# EAGLE design CoCoEPROMpak (EAGLE 6.4)
COMPANY_NAME: Mark J. Blair, NF6X; DOCUMENT_ID: CoCoEPROMpak_v1.0; REV: 1.0
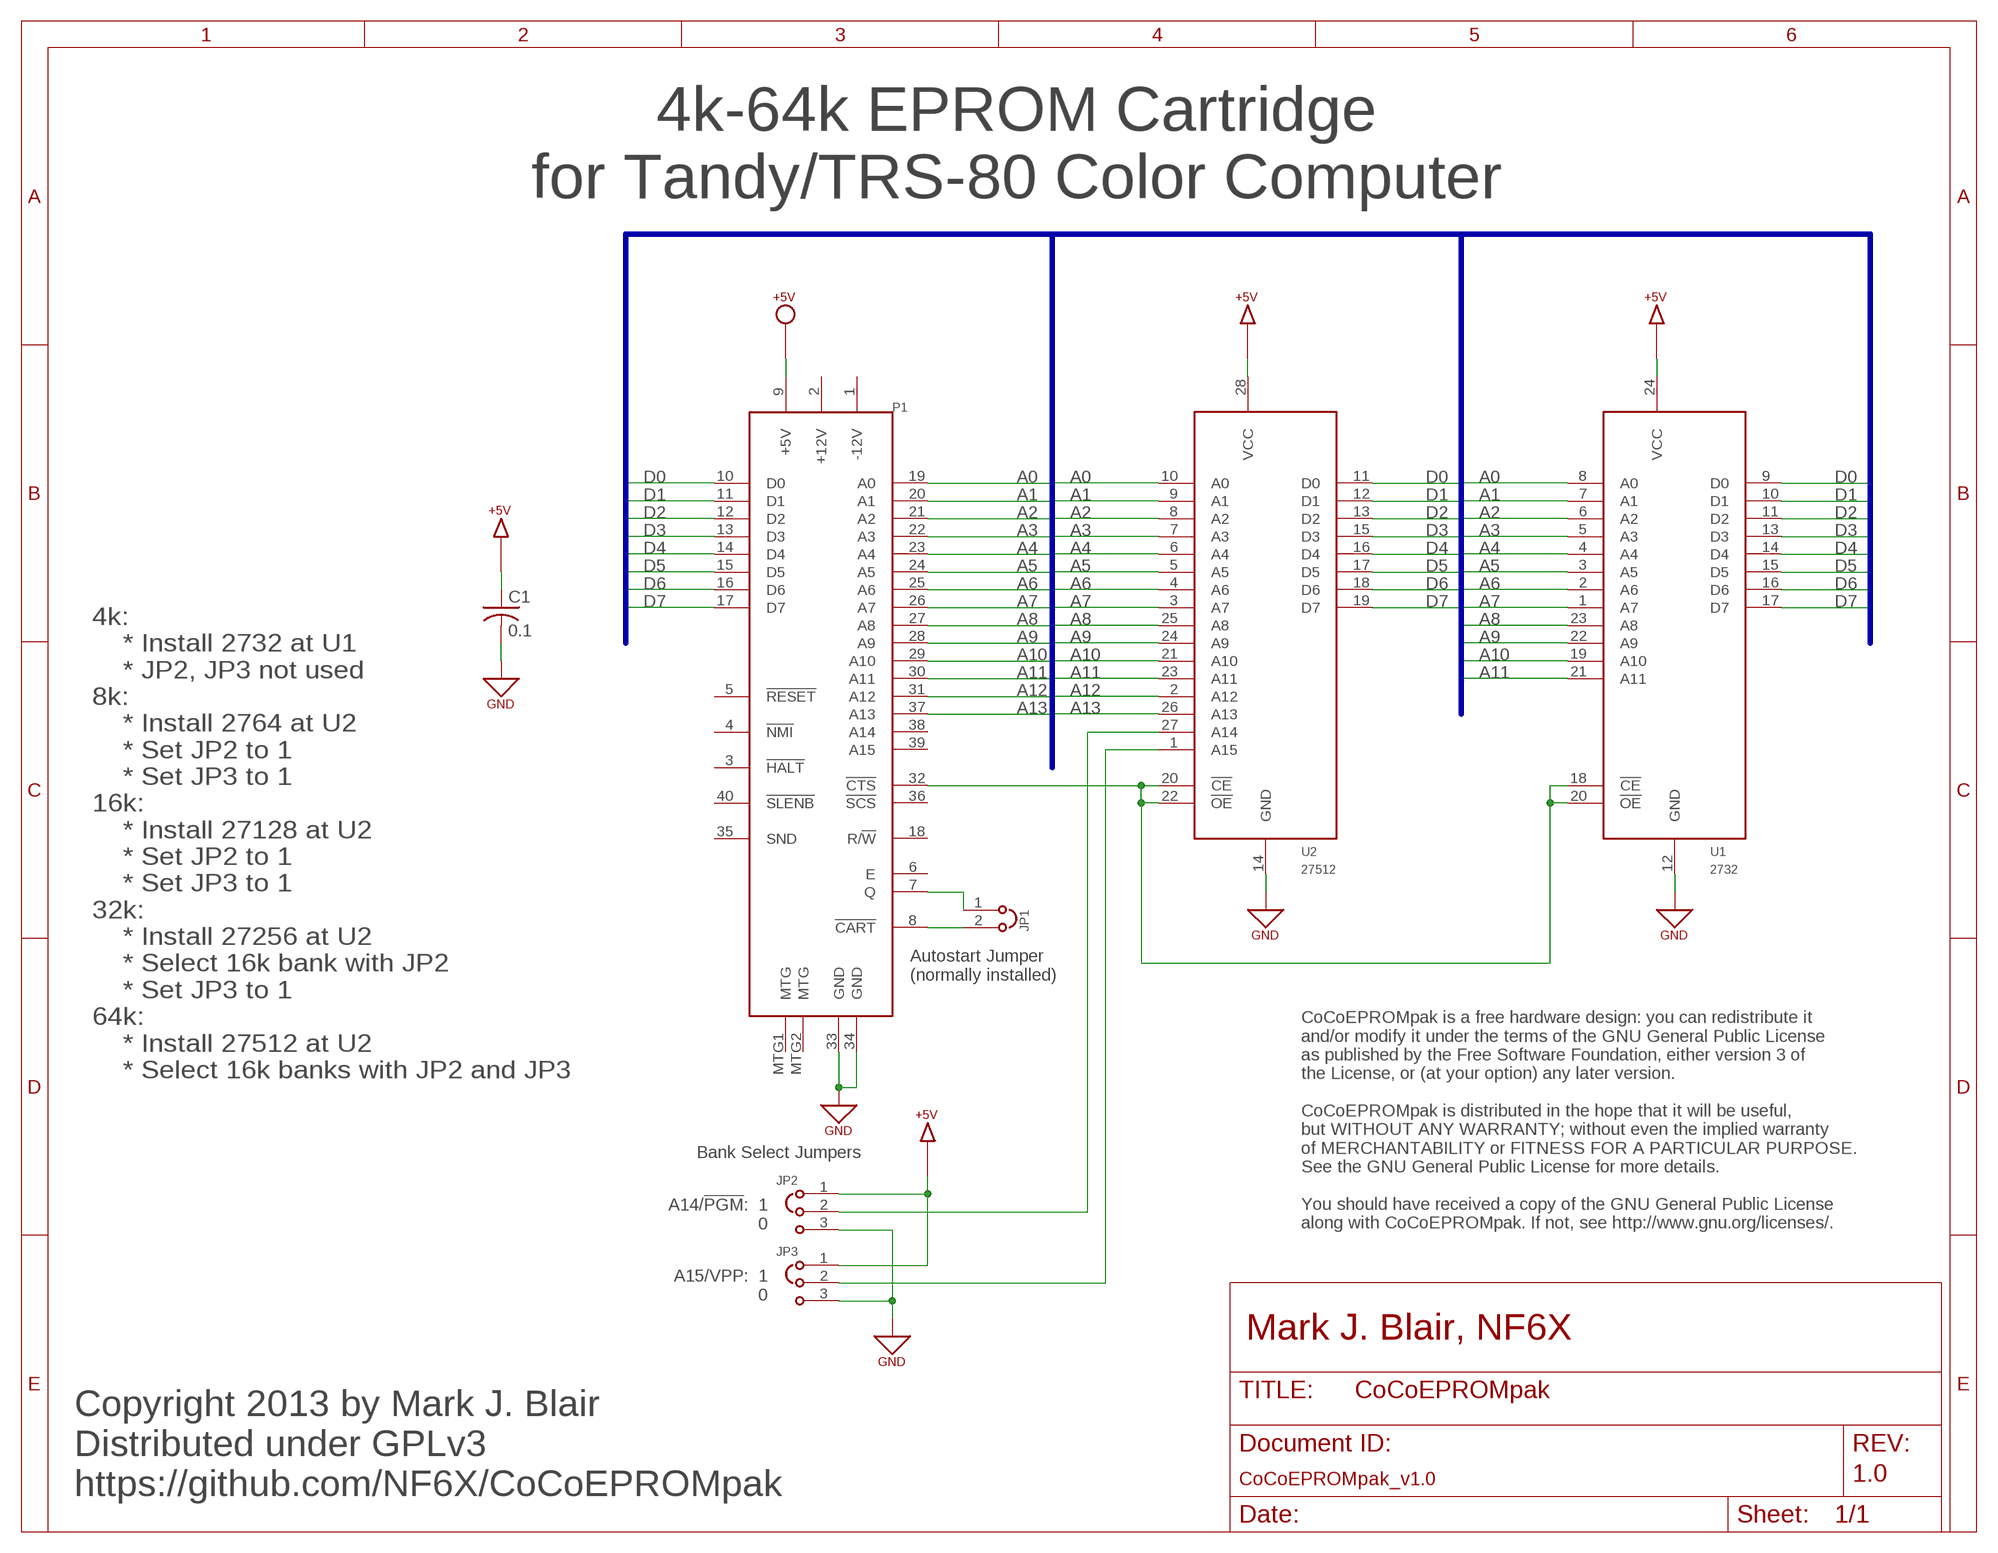
[diagram p0: schematic, sheet 1]

## Parts
C1  0.1  C-US050-025X075  [C050-025X075]
JP1  JP2  [JP2-100MIL]
JP2  JP3  [JP3-100MIL]
JP3  JP3  [JP3-100MIL]
P1  COCO-CART  [COCO-CART-2.1X1.75]
U1  2732  [DIL24]
U2  27512  [DIL28]

## Nets
+5V: C1.1 JP2.1 JP3.1 P1.9(+5V) U1.24(VCC) U2.28(VCC) ; supply symbol labelled +5V_CIRCLE, +5V_ARROW
A0: P1.19(A0) U1.8(A0) U2.10(A0)
A1: P1.20(A1) U1.7(A1) U2.9(A1)
A2: P1.21(A2) U1.6(A2) U2.8(A2)
A3: P1.22(A3) U1.5(A3) U2.7(A3)
A4: P1.23(A4) U1.4(A4) U2.6(A4)
A5: P1.24(A5) U1.3(A5) U2.5(A5)
A6: P1.25(A6) U1.2(A6) U2.4(A6)
A7: P1.26(A7) U1.1(A7) U2.3(A7)
A8: P1.27(A8) U1.23(A8) U2.25(A8)
A9: P1.28(A9) U1.22(A9) U2.24(A9)
A10: P1.29(A10) U1.19(A10) U2.21(A10)
A11: P1.30(A11) U1.21(A11) U2.23(A11)
A12: P1.31(A12) U2.2(A12)
A13: P1.37(A13) U2.26(A13)
D0: P1.10(D0) U1.9(D0) U2.11(D0)
D1: P1.11(D1) U1.10(D1) U2.12(D1)
D2: P1.12(D2) U1.11(D2) U2.13(D2)
D3: P1.13(D3) U1.13(D3) U2.15(D3)
D4: P1.14(D4) U1.14(D4) U2.16(D4)
D5: P1.15(D5) U1.15(D5) U2.17(D5)
D6: P1.16(D6) U1.16(D6) U2.18(D6)
D7: P1.17(D7) U1.17(D7) U2.19(D7)
GND: C1.2 JP2.3 JP3.3 P1.33(GND) P1.34(GND) U1.12(GND) U2.14(GND)
N$1: JP2.2 U2.27(A14)
N$2: P1.32(!CTS) U1.18(!CE) U1.20(!OE) U2.20(!CE) U2.22(!OE)
N$3: JP3.2 U2.1(A15)
N$4: JP1.2 P1.8(!CART)
N$5: JP1.1 P1.7(Q)
Unconnected: P1.1(-12V) P1.2(+12V) P1.3(!HALT) P1.4(!NMI) P1.5(!RESET) P1.6(E) P1.18(R/!W) P1.35(SND) P1.36(!SCS) P1.38(A14) P1.39(A15) P1.40(!SLENB) P1.MTG1(MTG) P1.MTG2(MTG)

## Buses
AD:A[0..13],D[0..7]

## Notes on the sheet
- 4k-64k EPROM Cartridge
  for Tandy/TRS-80 Color Computer
- Autostart Jumper
  (normally installed)
- 4k:
      * Install 2732 at U1
      * JP2, JP3 not used
  8k:
      * Install 2764 at U2
      * Set JP2 to 1
      * Set JP3 to 1
  16k:
      * Install 27128 at U2
      * Set JP2 to 1
      * Set JP3 to 1
  32k:
      * Install 27256 at U2
      * Select 16k bank with JP2
      * Set JP3 to 1
  64k:
      * Install 27512 at U2
      * Select 16k banks with JP2 and JP3
- Bank Select Jumpers
- A14/!PGM!:  1
  0
- CoCoEPROMpak is a free hardware design: you can redistribute it
  and/or modify it under the terms of the GNU General Public License
  as published by the Free Software Foundation, either version 3 of
  the License, or (at your option) any later version.
  
  CoCoEPROMpak is distributed in the hope that it will be useful,
  but WITHOUT ANY WARRANTY; without even the implied warranty
  of MERCHANTABILITY or FITNESS FOR A PARTICULAR PURPOSE.
  See the GNU General Public License for more details.
  
  You should have received a copy of the GNU General Public License
  along with CoCoEPROMpak. If not, see http://www.gnu.org/licenses/.
- A15/VPP:  1
  0
- Copyright 2013 by Mark J. Blair
  Distributed under GPLv3
  https://github.com/NF6X/CoCoEPROMpak

## Library data of the parts
C1 = resistor:C-US: CAPACITOR, American symbol
JP1 = switch:JP2: JP2: 2-Pin Jumper
JP2 JP3 = switch:JP3: JP3: 3-Pin Jumper
P1 = CoCo:COCO-CART: Tandy/TRS-80 Color Computer Cartridge Connector
U1 = EPROM:2732: 2732 4k x 8 EPROM
U2 = EPROM:27512: 27512 164k x 8 EPROM

## Board
CoCoEPROMpak 4k-64k EPROM-based ROM cartridge for the Tandy/TRS-80 Color Computer. Copyright 2013 Mark J. Blair Distributed under GPLv3 https://github.com/NF6X/CoCoEPROMpak CoCoEPROMpak is a free hardware design: you can redistribute it and/or modify it under the terms of the GNU General Public License as published by the Free Software Foundation, either version 3 of the License, or (at your option) any later version. CoCoEPROMpak is distributed in the hope that it will be useful, but WITHOUT ANY WARRANTY; without even the implied warranty of MERCHANTABILITY or FITNESS FOR A PARTICULAR PURPOSE. See the GNU General Public License for more details. You should have received a copy of the GNU General Public License along with CoCoEPROMpak. If not, see .
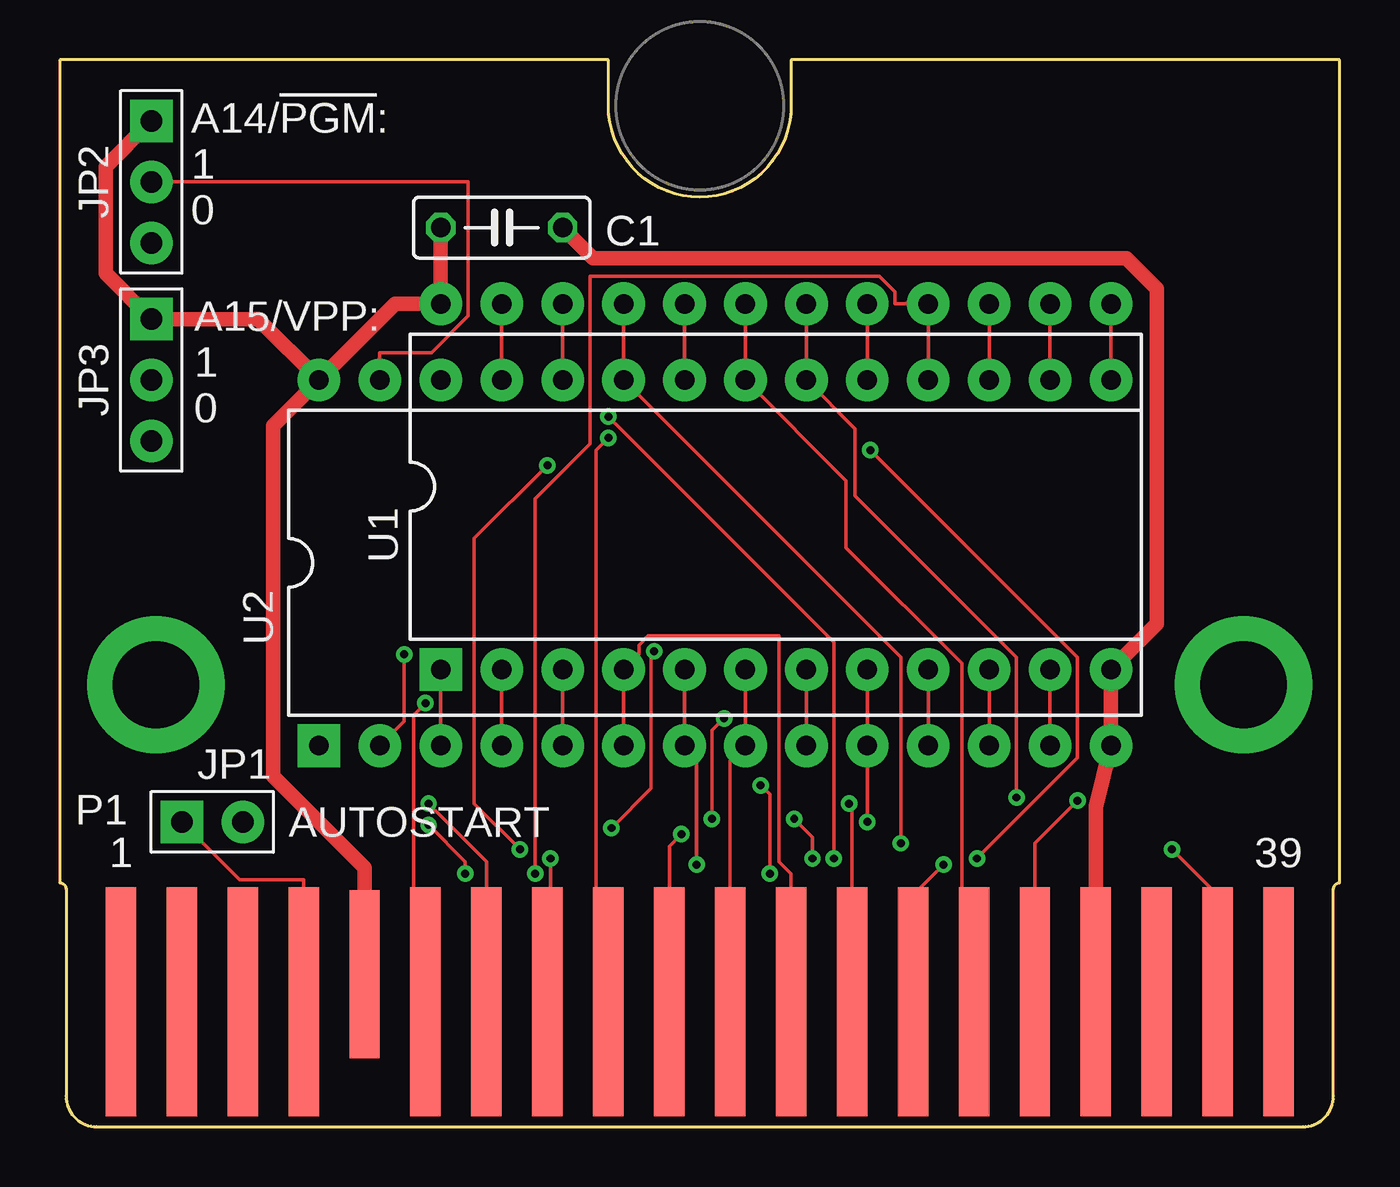
[diagram p1: board, top side]
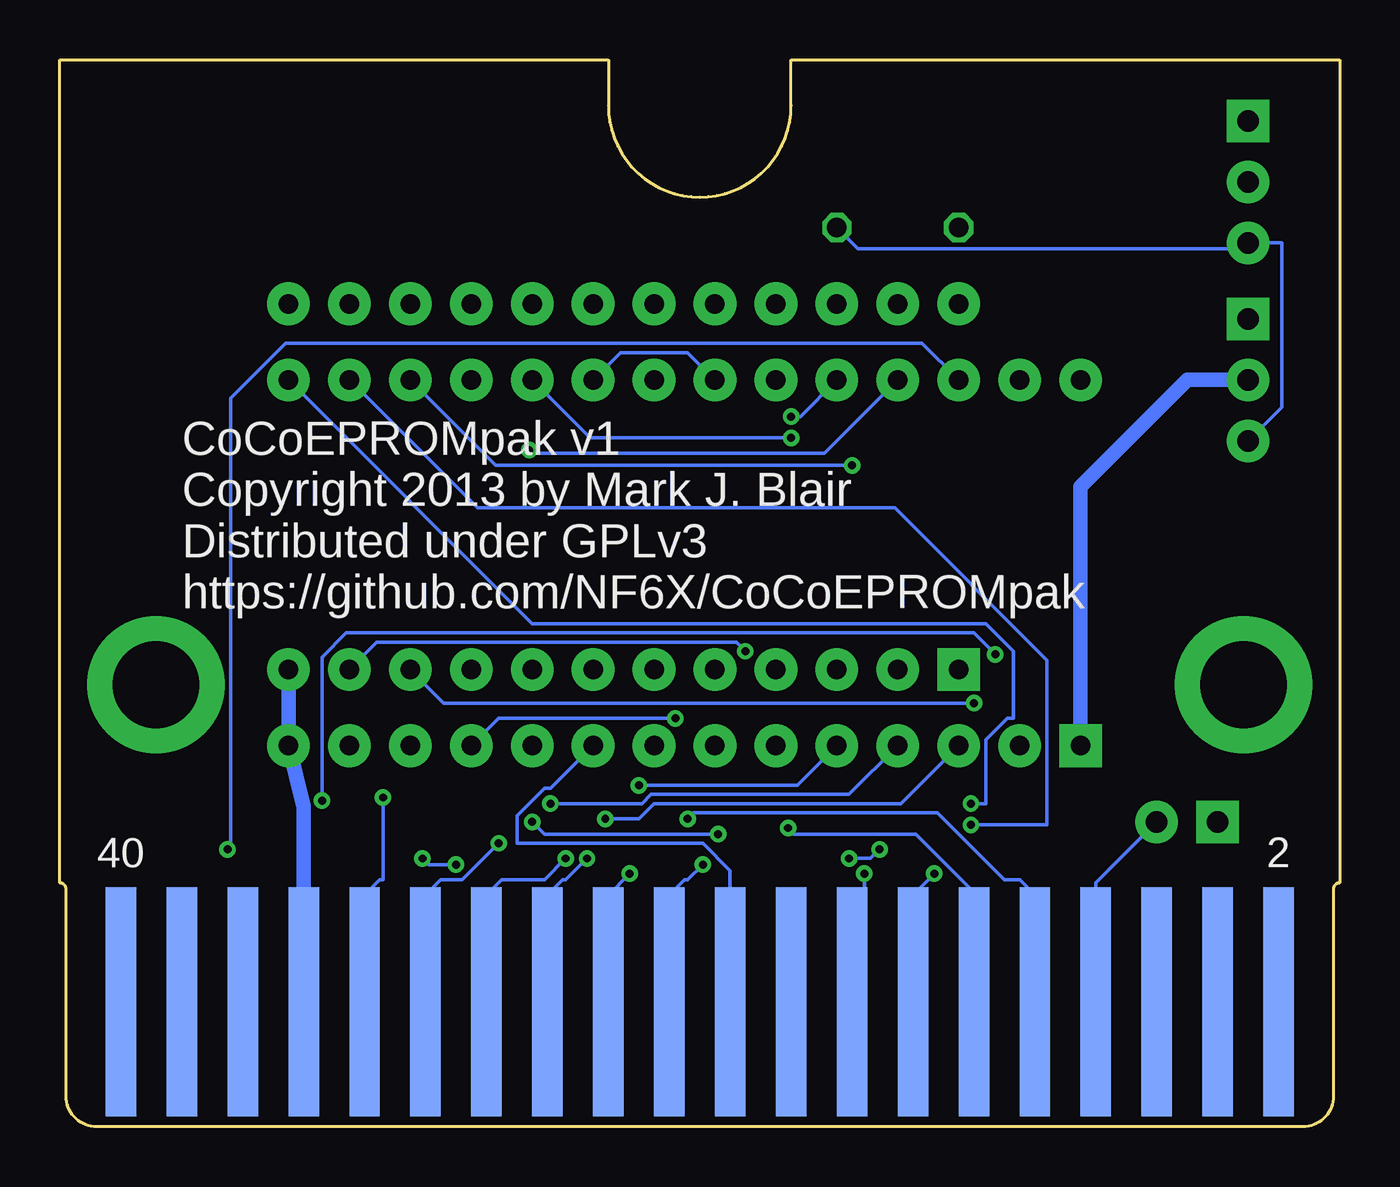
[diagram p2: board, bottom side, seen from below]

Size 53.34 x 44.45 mm. Coordinates in mm from the lower left corner, seen from the top.
Copper layers (1*16): Top 0.0356mm / dielectric 1.5011mm / Bottom 0.0356mm
Design rules "LaenPCBOrder *": minimum track width 6mil, minimum drill 13mil, track to track 6mil, track to pad 6mil, pad to pad 6mil, via to via 6mil, smd to smd 6mil, copper to edge 15mil, drill to drill 6mil, minimum pad ring 7mil, minimum via ring 7mil, stop-mask expansion 3mil, vias tented up to drill 25mil, thermal gap 10mil

### Footprints (pad centres in the part's own frame; a part is rotated, then mirrored left to right if it is on the bottom)
C050-025X075 = drill 0.813 octagon: 1 -2.54,0; 2 2.54,0
JP2-100MIL = drill 0.889 pad 1.778 square: 1 0,0 | drill 0.889 pad 1.778: 2 0,-2.54
JP3-100MIL = drill 0.889 pad 1.778 square: 1 0,0 | drill 0.889 pad 1.778: 2 0,-2.54; 3 0,-5.08
COCO-CART-2.1X1.75 = smd 1.27 x 9.525: 1 2.54,5.207; 3 5.08,5.207; 5 7.62,5.207; 7 10.16,5.207; 11 15.24,5.207; 13 17.78,5.207; 15 20.32,5.207; 17 22.86,5.207; 19 25.4,5.207; 21 27.94,5.207; 23 30.48,5.207; 25 33.02,5.207; 27 35.56,5.207; 29 38.1,5.207; 31 40.64,5.207; 33 43.18,5.207; 35 45.72,5.207; 37 48.26,5.207; 39 50.8,5.207 | smd 1.27 x 9.525 bottom: 2 2.54,5.207; 4 5.08,5.207; 6 7.62,5.207; 8 10.16,5.207; 10 12.7,5.207; 12 15.24,5.207; 14 17.78,5.207; 16 20.32,5.207; 18 22.86,5.207; 20 25.4,5.207; 22 27.94,5.207; 24 30.48,5.207; 26 33.02,5.207; 28 35.56,5.207; 30 38.1,5.207; 32 40.64,5.207; 34 43.18,5.207; 36 45.72,5.207; 38 48.26,5.207; 40 50.8,5.207 | smd 1.27 x 6.985: 9 12.7,6.35 | drill 3.607 pad 5.715: MTG1 4,18.415; MTG2 49.34,18.415
DIL24 = drill 0.813 pad 1.778 square: 1 -13.97,-7.62 | drill 0.813 pad 1.778: 2 -11.43,-7.62; 3 -8.89,-7.62; 4 -6.35,-7.62; 5 -3.81,-7.62; 6 -1.27,-7.62; 7 1.27,-7.62; 8 3.81,-7.62; 9 6.35,-7.62; 10 8.89,-7.62; 11 11.43,-7.62; 12 13.97,-7.62; 13 13.97,7.62; 14 11.43,7.62; 15 8.89,7.62; 16 6.35,7.62; 17 3.81,7.62; 18 1.27,7.62; 19 -1.27,7.62; 20 -3.81,7.62; 21 -6.35,7.62; 22 -8.89,7.62; 23 -11.43,7.62; 24 -13.97,7.62
DIL28 = drill 0.813 pad 1.778 square: 1 -16.51,-7.62 | drill 0.813 pad 1.778: 2 -13.97,-7.62; 3 -11.43,-7.62; 4 -8.89,-7.62; 5 -6.35,-7.62; 6 -3.81,-7.62; 7 -1.27,-7.62; 8 1.27,-7.62; 9 3.81,-7.62; 10 6.35,-7.62; 11 8.89,-7.62; 12 11.43,-7.62; 13 13.97,-7.62; 14 16.51,-7.62; 15 16.51,7.62; 16 13.97,7.62; 17 11.43,7.62; 18 8.89,7.62; 19 6.35,7.62; 20 3.81,7.62; 21 1.27,7.62; 22 -1.27,7.62; 23 -3.81,7.62; 24 -6.35,7.62; 25 -8.89,7.62; 26 -11.43,7.62; 27 -13.97,7.62; 28 -16.51,7.62

### Placement (x,y rotation side)
C1  18.41,37.47 0 top
JP1  5.08,12.7 90 top
JP2  3.81,41.91 0 top
JP3  3.81,33.66 0 top
P1  0,0 0 top
U1  29.84,26.67 0 top
U2  27.3,23.5 0 top

### Tracks (layer width: path | path; a pad name or v marks a point on that pad's centre or on a via)
+5V
  Top 0.61: C1.1 U1.24 13.97,34.29 U2.28 | P1.9 12.7,10.79 8.89,14.61 8.89,29.21 U2.28 | U2.28 8.26,33.66 JP3.1 1.91,35.56 1.91,40.01 JP2.1
A0  (via drill 0.33)
  Top 0.152: U1.8 U2.10 v33.66,12.7 | v25.91,12.19 25.4,11.68 P1.19
  Bottom 0.152: v33.66,12.7 33.15,12.19 v25.91,12.19
A1
  Top 0.152: U1.7 U2.9
  Bottom 0.152: U2.9 32.89,14.1 33.15,14.1 34.29,12.95 34.29,11.81 26.54,11.81 25.4,10.67 P1.20
A2
  Top 0.152: U1.6 U2.8 27.94,15.24 P1.21
A3  (via drill 0.33)
  Top 0.152: U1.5 U2.7 26.54,15.37 v26.54,10.92
  Bottom 0.152: v26.54,10.92 27.18,10.29 27.3,10.29 27.94,9.65 P1.22
A4
  Top 0.152: U2.6 U1.4 24.13,19.68 24.13,20.07 24.51,20.45 29.97,20.45 29.97,11.05 30.48,10.54 P1.23
A5  (via drill 0.33)
  Top 0.152: U1.3 U2.5 | v29.21,14.22 29.59,13.84 v29.59,10.54
  Bottom 0.152: U2.5 22.61,14.22 v29.21,14.22 | v29.59,10.54 30.48,9.65 P1.24
A6  (via drill 0.33)
  Top 0.152: U1.2 U2.4 | v32.89,13.46 33.02,13.34 P1.25
  Bottom 0.152: U2.4 20.45,13.84 28.7,13.84 29.08,13.46 v32.89,13.46
A7  (via drill 0.33)
  Top 0.152: U1.1 U2.3 | v30.61,12.83 31.37,12.06 v31.37,11.18
  Bottom 0.152: U2.3 18.29,13.46 28.57,13.46 29.21,12.83 v30.61,12.83 | v31.37,11.18 32.26,10.29 32.38,10.29 33.02,9.65 P1.26
A8  (via drill 0.33)
  Top 0.152: U1.23 U2.25 | v33.78,28.19 42.42,19.56 42.42,15.37 v38.23,11.18 | v36.83,10.92 35.56,9.65 P1.27
  Bottom 0.152: U2.25 21.46,28.07 33.66,28.07 v33.78,28.19 | v38.23,11.18 37.97,10.92 v36.83,10.92
A9  (via drill 0.33)
  Top 0.152: U1.22 U2.24 | v22.86,29.59 32.26,20.19 v32.26,11.18
  Bottom 0.152: U2.24 22.48,29.59 v22.86,29.59 | v32.26,11.18 33.15,10.29 34.92,10.29 35.56,9.65 P1.28
A10
  Top 0.152: U1.19 U2.21 32.77,26.92 32.77,24.13 37.59,19.3 37.59,5.71 P1.29
A11  (via drill 0.33)
  Top 0.152: U1.21 U2.23 35.05,19.56 v35.05,11.81
  Bottom 0.152: v35.05,11.81 36.58,10.29 37.47,10.29 38.1,9.65 P1.30
A12  (via drill 0.33)
  Top 0.152: U2.2 14.35,16.89 v14.35,19.68 | v42.42,13.59 40.64,11.81 P1.31
  Bottom 0.152: v14.35,19.68 15.24,20.57 41.4,20.57 42.42,19.56 v42.42,13.59
A13  (via drill 0.33)
  Top 0.152: v46.35,11.56 48.26,9.65 P1.37
  Bottom 0.152: U2.26 17.4,32.64 43.94,32.64 46.23,30.35 46.23,11.56 v46.35,11.56
D0  (via drill 0.33)
  Top 0.152: U1.9 U2.11 | v27.69,17.02 27.18,16.51 v27.18,12.83
  Bottom 0.152: U2.11 35.05,17.02 v27.69,17.02 | v27.18,12.83 26.92,13.08 16.76,13.08 13.97,10.29 13.34,10.29 12.7,9.65 P1.10
D1  (via drill 0.33)
  Top 0.152: U1.10 U2.12 | v15.24,17.65 14.73,17.14 14.73,5.71 P1.11
  Bottom 0.152: U1.10 37.34,17.65 v15.24,17.65
D2  (via drill 0.33)
  Top 0.152: U1.11 U2.13 | v24.77,19.81 24.64,19.68 24.64,14.1 v22.99,12.45
  Bottom 0.152: U1.11 40.13,20.19 25.15,20.19 v24.77,19.81 | v22.99,12.45 22.73,12.19 17.65,12.19 15.24,9.78 P1.12
D3  (via drill 0.33)
  Top 0.152: U1.13 U2.15 | v15.37,13.46 17.78,11.05 P1.13
  Bottom 0.152: U2.15 33.66,20.95 14.73,20.95 13.59,19.81 13.59,17.02 13.84,17.02 14.73,16.13 14.73,13.46 v15.37,13.46
D4  (via drill 0.33)
  Top 0.152: U1.14 U2.16 | v15.37,12.57 16.89,11.05 v16.89,10.54
  Bottom 0.152: U2.16 35.94,25.78 18.54,25.78 12.19,19.43 12.19,12.57 v15.37,12.57 | v16.89,10.54 17.78,9.65 P1.14
D5  (via drill 0.33)
  Top 0.152: U1.15 U2.17 | v20.32,27.56 17.27,24.51 17.27,13.46 v19.18,11.56 | v20.45,11.18 20.45,5.33 P1.15
  Bottom 0.152: U2.17 35.18,27.56 v20.32,27.56 | v19.18,11.56 19.56,11.18 v20.45,11.18
D6  (via drill 0.33)
  Top 0.152: U2.18 U1.16 34.8,34.29 34.8,34.8 34.16,35.43 22.1,35.43 22.1,28.45 19.81,26.16 v19.81,10.54
  Bottom 0.152: v19.81,10.54 19.81,5.21 P1.16
D7  (via drill 0.33)
  Top 0.152: U1.17 U2.19 | v22.86,28.7 22.35,28.19 22.35,5.71 P1.17
  Bottom 0.152: U2.19 31.24,28.7 v22.86,28.7
GND
  Top 0.61: P1.34 43.18,13.34 U2.14 U1.12 45.72,20.95 45.72,34.92 44.45,36.2 22.23,36.2 C1.2
  Bottom 0.152: JP3.3 2.41,29.97 2.41,36.83 JP2.3 4.06,36.58 20.07,36.58 C1.2
  Bottom 0.61: P1.34 43.18,13.34 U2.14 U1.12
N$1
  Top 0.152: JP2.2 17.02,39.37 17.02,33.78 15.49,32.26 13.34,32.26 U2.27
N$2  (via drill 0.33)
  Top 0.152: U1.20 U2.22 | U1.18 U2.20 33.15,29.08 33.15,26.29 39.88,19.56 v39.88,13.72
  Bottom 0.152: U2.22 27.18,32.26 29.97,32.26 U2.20 | v39.88,13.72 39.88,10.29 40.01,10.29 40.64,9.65 P1.32
N$3
  Bottom 0.61: U2.1 10.79,26.67 6.35,31.11 JP3.2
N$4
  Bottom 0.152: JP1.2 10.16,10.16 P1.8
N$5
  Top 0.152: JP1.1 7.49,10.29 10.16,10.29 P1.7

### Text on the board
tPlace: A14/!PGM!: / 1 / 0 | A15/VPP: / 1 / 0 | AUTOSTART
bPlace: CoCoEPROMpak v1 / Copyright 2013 by Mark J. Blair / Distributed under GPLv3 / https://github.com/NF6X/CoCoEPROMpak
tStop: CoCoEPROMpak / by NF6X